# Altium schematic sheet x-IMU3-SA-D3.SchDoc
size A4; SheetNumber: 1; SheetTotal: 1
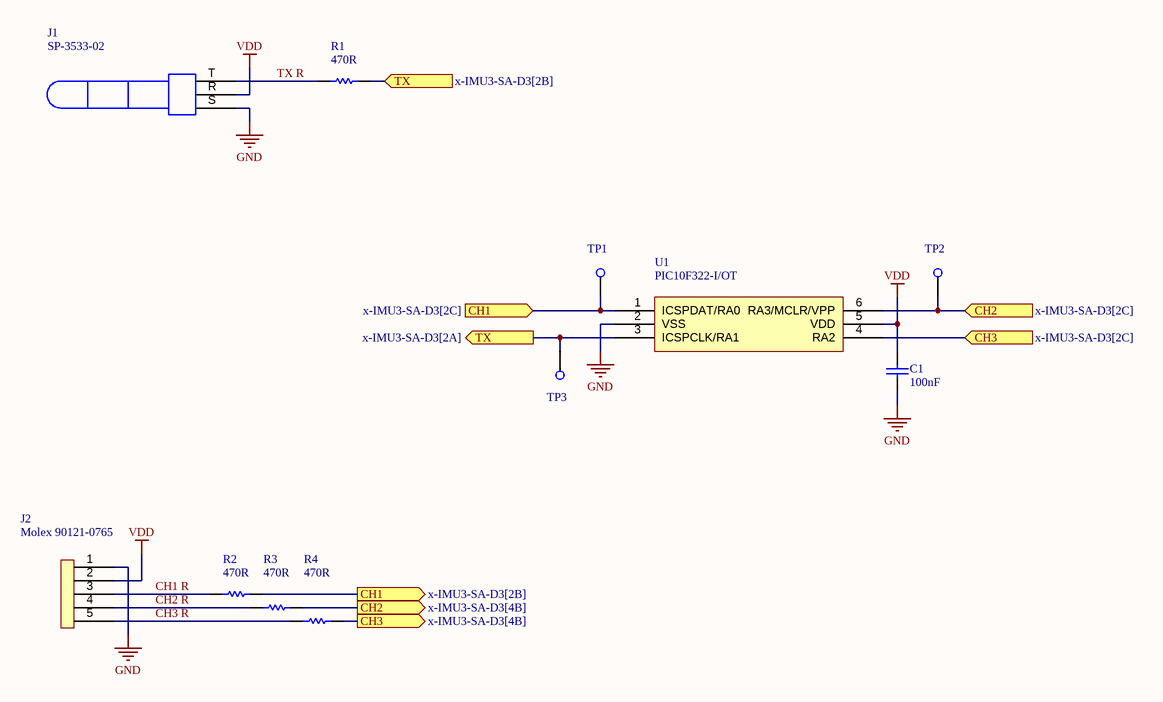
[diagram p0: x-IMU3-SA-D3.SchDoc]

## Parts
C1  100nF  [Capacitor 0402]
J1  SP-3533-02  [SP-3533-02]
J2  Molex 90121-0765  [Molex 90121-0765]
R1  470R  [Resistor 0402]
R2  470R  [Resistor 0402]
R3  470R  [Resistor 0402]
R4  470R  [Resistor 0402]
TP1  Test Point  [Test Point 1mm]  (value not drawn)
TP2  Test Point  [Test Point 1mm]  (value not drawn)
TP3  Test Point  [Test Point 1mm]  (value not drawn)
U1  PIC10F322-I/OT  [SOT-23-6]

## Ports
CH1 (in, see x-IMU3-SA-D3[2C]), CH1 (out, see x-IMU3-SA-D3[2B]), CH2 (in, see x-IMU3-SA-D3[2C]), CH2 (out, see x-IMU3-SA-D3[4B]), CH3 (in, see x-IMU3-SA-D3[2C]), CH3 (out, see x-IMU3-SA-D3[4B]), TX (in, see x-IMU3-SA-D3[2B]), TX (out, see x-IMU3-SA-D3[2A])

## Nets
GND: C1.1 J1.S J2.1 U1.2(VSS)
VDD: C1.2 J1.R J2.2 U1.5(VDD)
CH1: R2.2 TP1.1 U1.1(ICSPDAT/RA0) ; port CH1
CH1 R: J2.3 R2.1
CH2: R3.2 TP2.1 U1.6(RA3/MCLR/VPP) ; port CH2
CH2 R: J2.4 R3.1
CH3: R4.2 U1.4(RA2) ; port CH3
CH3 R: J2.5 R4.1
TX: R1.2 TP3.1 U1.3(ICSPCLK/RA1) ; port TX
TX R: J1.T R1.1

## Notes on the sheet
- TITLE
- SIZE
- A4
- VARIANT
- PROJECT
- SHEET
- VERSION
- OF
- AUTHOR
- DATE

## Library data of the parts
C1 = Capacitor
R1-R4 = Resistor